# Altium schematic sheet ExampleCircuit.SchDoc
size A3; SheetNumber: 2; SheetTotal: 3
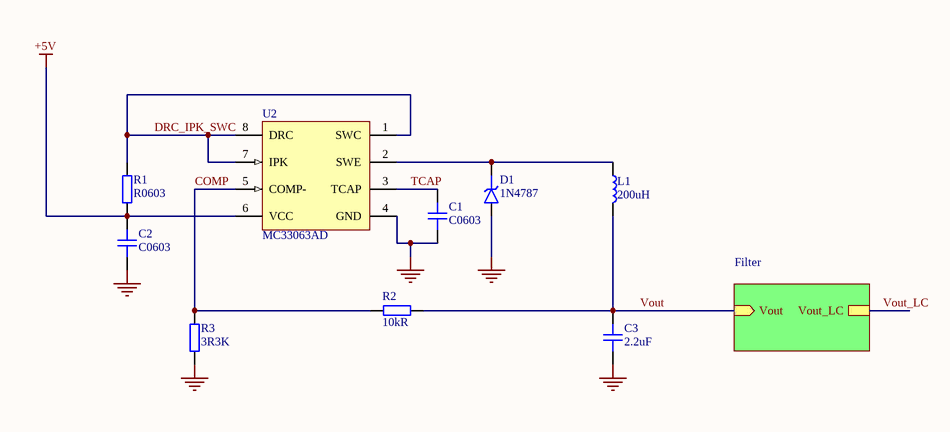
[diagram p0: ExampleCircuit.SchDoc]

## Parts
C1  C0603  [CAP_0603]
C2  C0603  [CAP_0603]
C3  2.2uF  [CAP_0603]
D1  1N4787  [SOD-323]
L1  200uH  [IND_0603]
R1  R0603  [RES_0603]
R2  10kR  [RES_0603]
R3  3R3K  [RES_0603]
U2  MC33063AD  [D0008A_N]

## Sub-sheets
Filter = Filter.SchDoc: Vout (in), Vout_LC

## Nets
+5V: C2.2 R1.2 U2.6(VCC)
GND: C1.1 C2.1 C3.2 D1.A R3.2 U2.4(GND)
COMP: R2.2 R3.1 U2.5(COMP-)
DRC_IPK_SWC: R1.1 U2.1(SWC) U2.7(IPK) U2.8(DRC)
TCAP: C1.2 U2.3(TCAP)
Vout: C3.1 L1.2 R2.1 ; sheet Filter/Vout
Vout_LC: sheet Filter/Vout_LC
NetD1_K: D1.K L1.1 U2.2(SWE)

## Library data of the parts
C1-C3 = CAP_0603: Capacitor SMD 0603; Manufacturer: *; Manufacturer Part Number: *; Distributor Link: *; LCSC: *; Rating: *; Dielectric: *
D1 = D_ZENER_SOD_323: Diode Zener SMD SOD-323
L1 = IND_0603: Inductor SMD 0603
R1-R3 = RES_0603: Resistor SMD 0603; Manufacturer: *; Manufacturer Part Number: *; Distributor Link: *; LCSC: *
U2 = CMP-0323-00189-3: Inverting Buck-Boost Regulator with 3 to 40 V Input and 1.25 to 40 V Output, -40 to 85 degC, 8-Pin SOIC (D), Green (RoHS & no Sb/Br); Manufacturer: Texas Instruments; Vout(Min)(V): 1.25; Vout(Max)(V): 40; Regulated Outputs(#): 1; Vin(Min)(V): 3; Iout(Max)(A): 0.75; Rating: Catalog; SubFamily: Step-Down Regulator; Switch Current Limit(Typ)(A): 1.5; Code_JEDEC: MS-012AA; Mounting Technology: Surface Mount; PackageVersion: revM, Jun-2011; ComponentLink3Description: URL Link1; Topology: Inverting Buck-Boost; Eco-Plan: Green (RoHS & no Sb/Br); ComponentLink3URL: Samples URL:http://www.ti.com/product/mc33063a#samples; DatasheetVersion: SLLS636M; PackageReference: D0008A; ComponentLink2Description: Package Specification; Vin(Max)(V): 40; ComponentLink1URL: http://www.ti.com/general/docs/lit/getliterature.tsp?genericPartNumber=MC33063A&fileType=pdf; PackageDescription: 8-Pin Plastic Small Outline Integrated Circuit, 4.9 x 3.9 mm, Pitch 1.27 mm Pitch; ComponentLink2URL: http://www.ti.com/litv/pdf/msoi002j; ComponentLink1Description: Datasheet; PartNumber: MC33063AD